# Altium schematic sheet SHDN-BSPD-S12-V00-Conntector.SchDoc
size A3
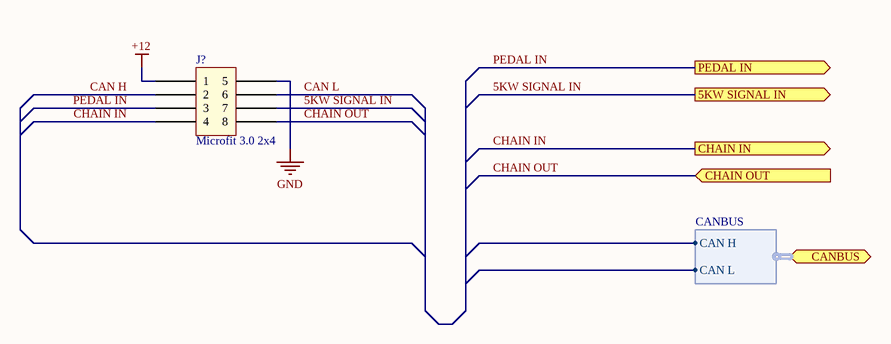
[diagram p0: SHDN-BSPD-S12-V00-Conntector.SchDoc]

## Parts
J?  Microfit 3.0 2x4  [Microfit_2X4_R_TH]

## Ports
5KW SIGNAL IN (out), CANBUS (bidir, harness CANBUS), CHAIN IN (out), CHAIN OUT (in), PEDAL IN (out)

## Harnesses
CANBUS: CAN H, CAN L

## Nets
+12: J?.1
GND: J?.5
5KW SIGNAL IN: J?.7 ; port 5KW SIGNAL IN
CAN H: J?.2
CAN L: J?.6
CHAIN IN: J?.4 ; port CHAIN IN
CHAIN OUT: J?.8 ; port CHAIN OUT
PEDAL IN: J?.3 ; port PEDAL IN

## Notes on the sheet
- Title
- Size:
- Date:
- A3
- Number:
- Time:
- Revision:
- Sheet
- of
- File:

## Library data of the parts
J? = Microfit_2x4